# EAGLE schematic CT63_v1.0 (EAGLE 9.6.2)

## Sheet 1 of 3
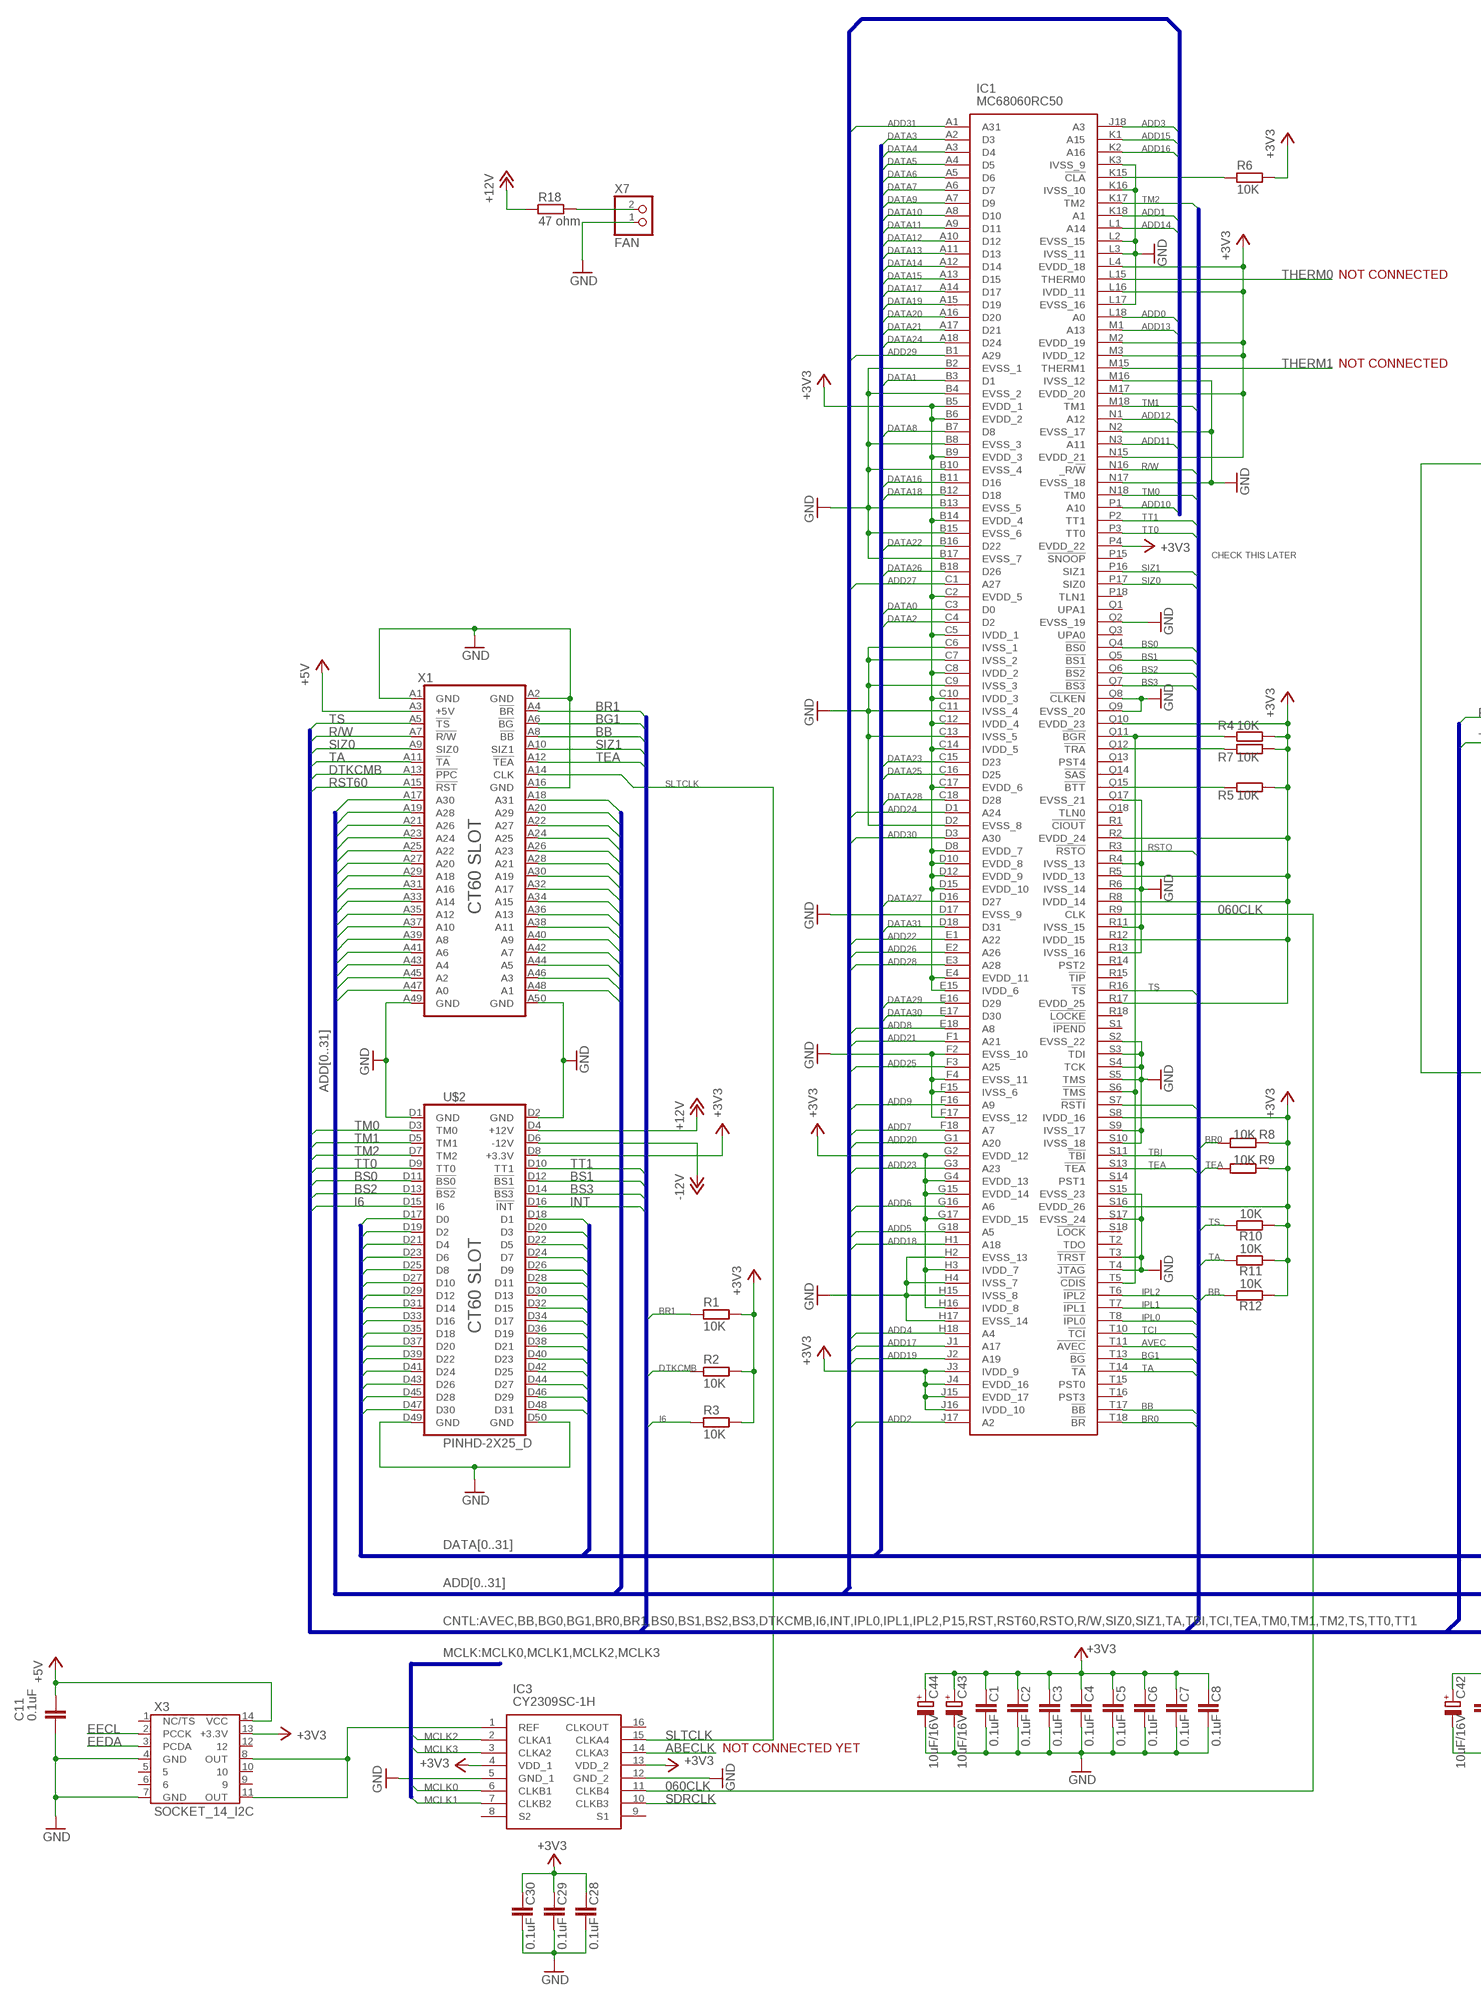
[diagram p0: schematic, sheet 1, part 1 of 2]
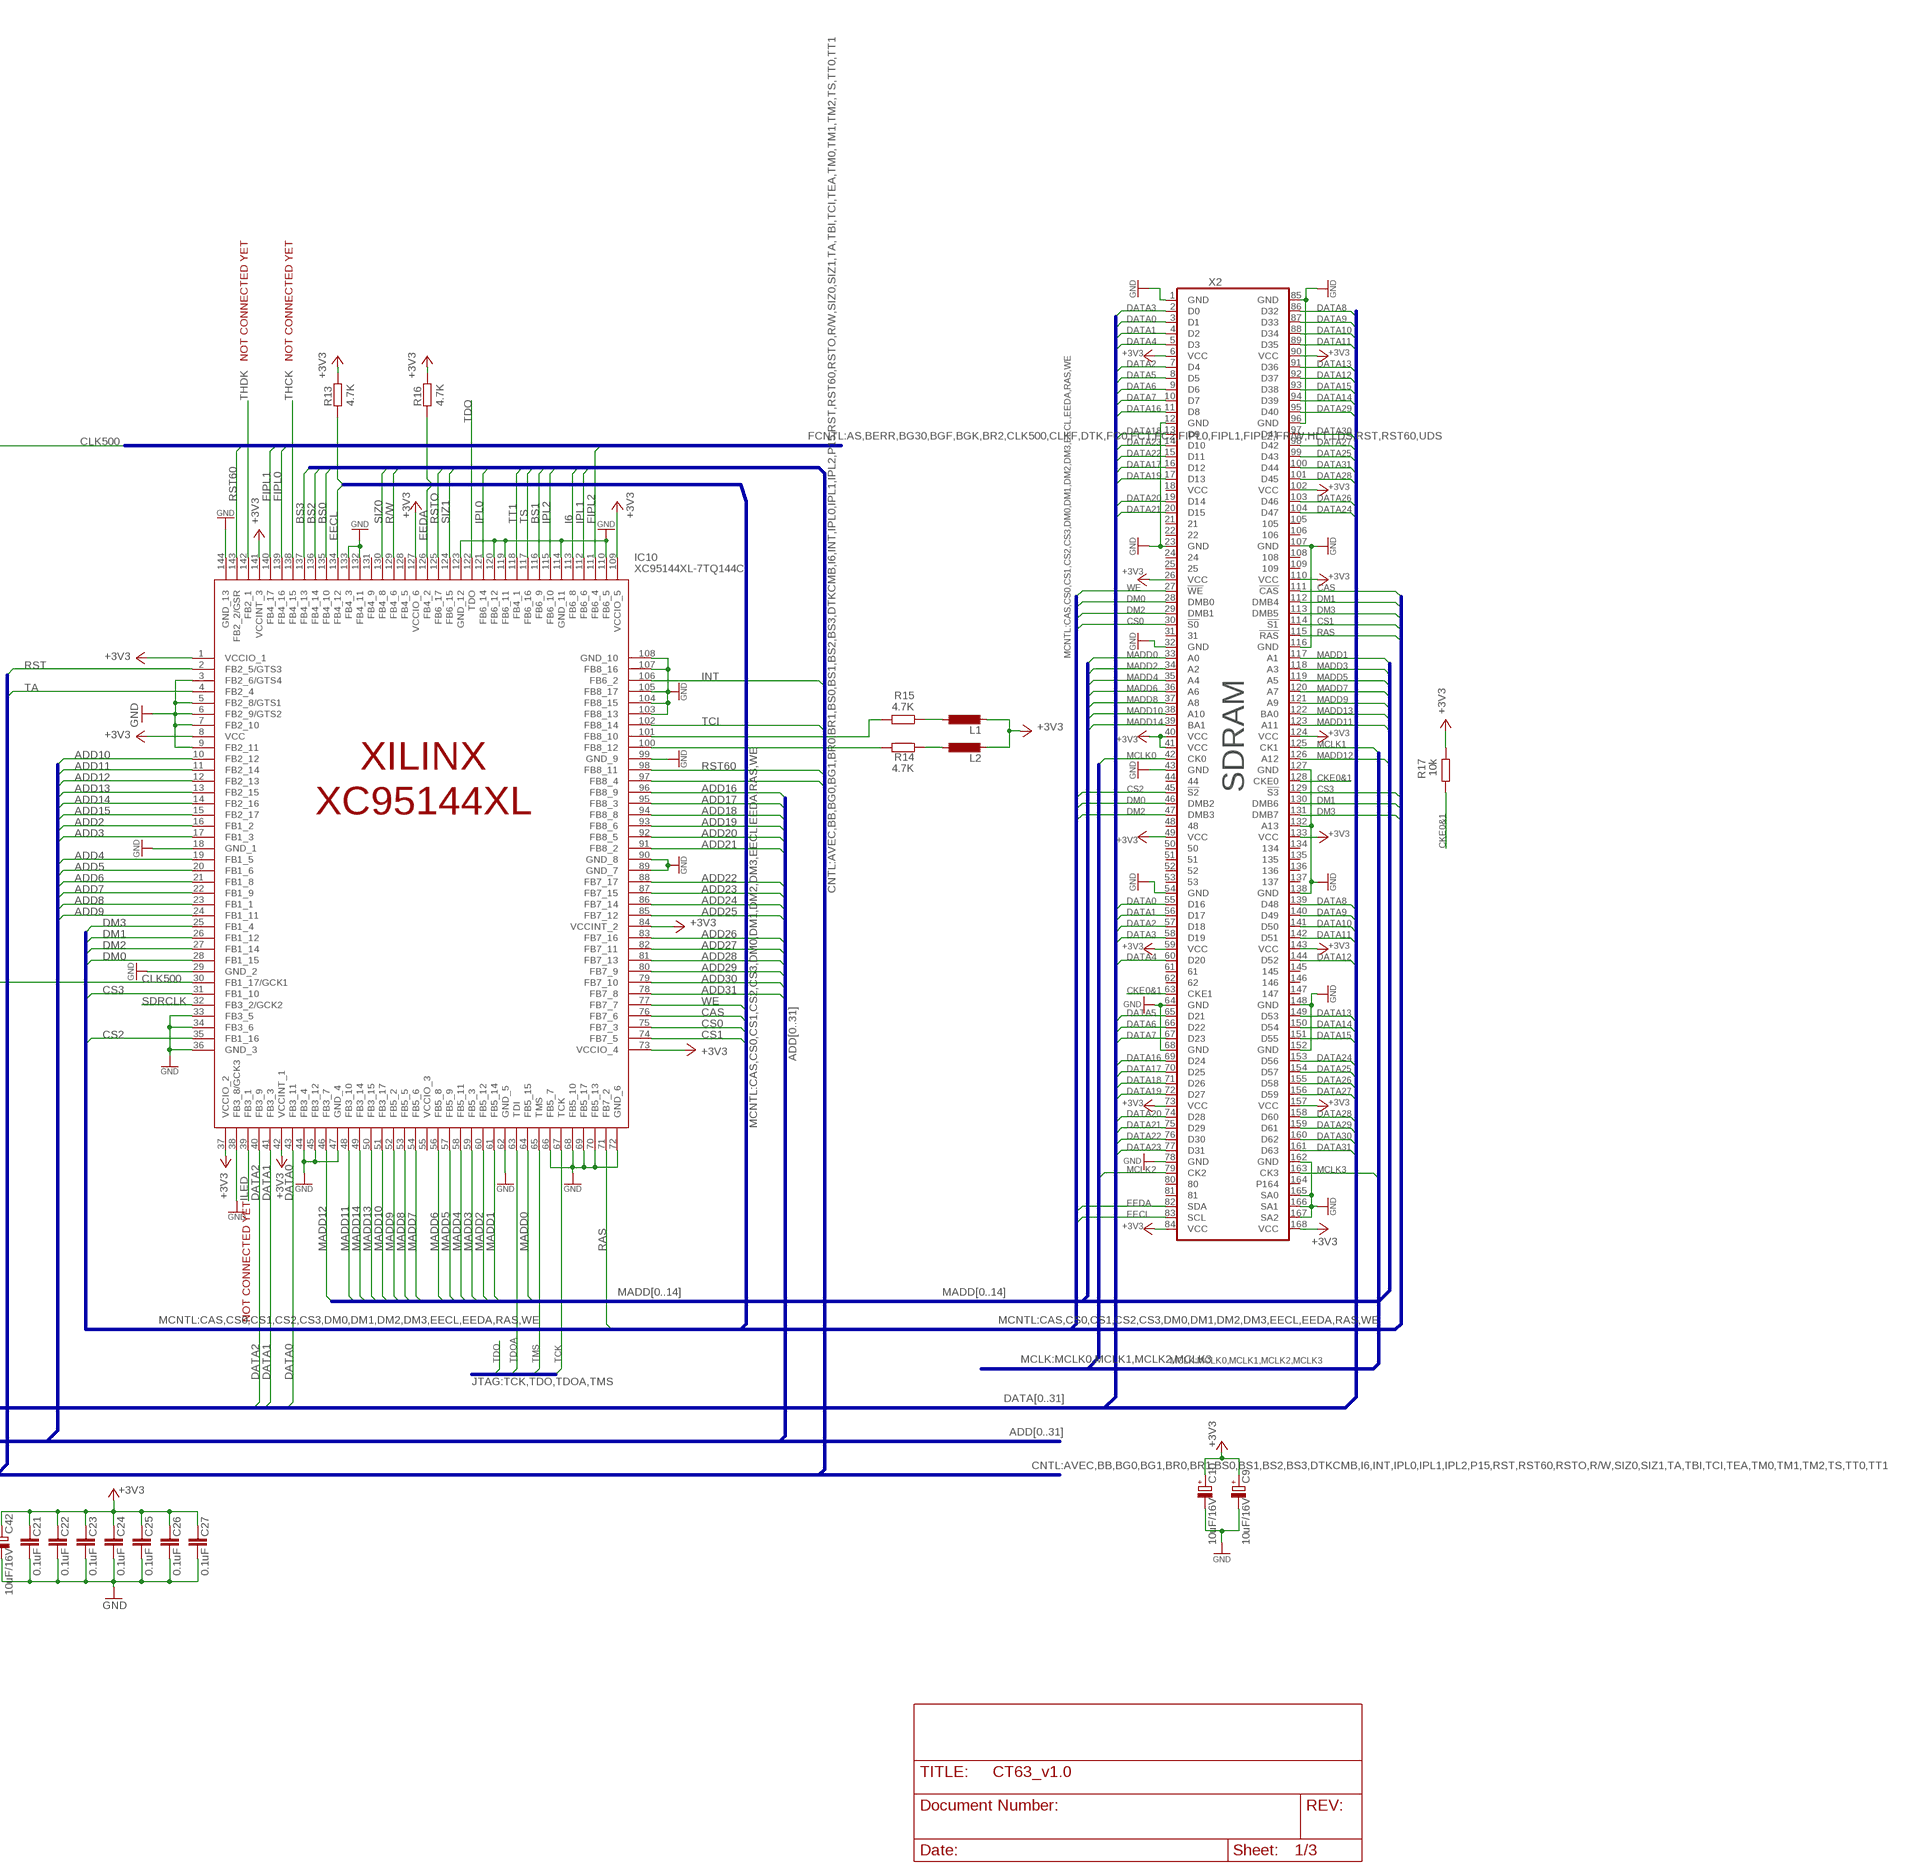
[diagram p1: schematic, sheet 1, part 2 of 2]

### Parts
C1  0.1uF  C-EUC0805  [C0805]
C2  0.1uF  C-EUC0805  [C0805]
C3  0.1uF  C-EUC0805  [C0805]
C4  0.1uF  C-EUC0805  [C0805]
C5  0.1uF  C-EUC0805  [C0805]
C6  0.1uF  C-EUC0805  [C0805]
C7  0.1uF  C-EUC0805  [C0805]
C8  0.1uF  C-EUC0805  [C0805]
C9  10uF/16V  CPOL-EUE2,5-6E  [E2,5-6E]
C10  10uF/16V  CPOL-EUE2,5-6E  [E2,5-6E]
C11  0.1uF  C-EUC0805  [C0805]
C21  0.1uF  C-EUC0805  [C0805]
C22  0.1uF  C-EUC0805  [C0805]
C23  0.1uF  C-EUC0805  [C0805]
C24  0.1uF  C-EUC0805  [C0805]
C25  0.1uF  C-EUC0805  [C0805]
C26  0.1uF  C-EUC0805  [C0805]
C27  0.1uF  C-EUC0805  [C0805]
C28  0.1uF  C-EUC0805  [C0805]
C29  0.1uF  C-EUC0805  [C0805]
C30  0.1uF  C-EUC0805  [C0805]
C42  10uF/16V  CPOL-EUE2,5-6E  [E2,5-6E]
C43  10uF/16V  CPOL-EUE2,5-6E  [E2,5-6E]
C44  10uF/16V  CPOL-EUE2,5-6E  [E2,5-6E]
IC1  MC68060RC50  [MC68060RC50]
IC3  CY2309SC-1H  [SOP65P638X110-16N]
IC10  XC95144XL-7TQ144C  [QFP50P2200X2200X160-144N]
L1  L-EUL3216C  [L3216C]
L2  L-EUL3216C  [L3216C]
R1  10K  R-EU_R0805  [R0805]
R2  10K  R-EU_R0805  [R0805]
R3  10K  R-EU_R0805  [R0805]
R4  10K  R-EU_R0805  [R0805]
R5  10K  R-EU_R0805  [R0805]
R6  10K  R-EU_R0805  [R0805]
R7  10K  R-EU_R0805  [R0805]
R8  10K  R-EU_R0805  [R0805]
R9  10K  R-EU_R0805  [R0805]
R10  10K  R-EU_R0805  [R0805]
R11  10K  R-EU_R0805  [R0805]
R12  10K  R-EU_R0805  [R0805]
R13  4.7K  R-EU_R0805  [R0805]
R14  4.7K  R-EU_R0805  [R0805]
R15  4.7K  R-EU_R0805  [R0805]
R16  4.7K  R-EU_R0805  [R0805]
R17  10k  R-EU_R0805  [R0805]
R18  47 ohm  R-EU_R0805  [R0805]
U$2  PINHD-2X25_D  [2X25_D]
X1  PINHD-2X25_A_2.54  [2X25_A]
X2  DIMM168  [390052-4]
X3  SOCKET_14_I2C  SOCKET14_I2C  [DIL14]
X7  FAN  JST_2PIN-THM  [JST-PH-2-THM]

### Nets
060CLK: IC1.R9(CLK) IC3.11(CLKB4)
+3V3: C1.1 C2.1 C3.1 C4.1 C5.1 C6.1 C7.1 C8.1 C9.+ C10.+ C21.1 C22.1 C23.1 C24.1 C25.1 C26.1 C27.1 C28.1 C29.1 C30.1 C42.+ C43.+ C44.+ IC1.B5(EVDD_1) IC1.B6(EVDD_2) IC1.B9(EVDD_3) IC1.B14(EVDD_4) IC1.C2(EVDD_5) IC1.C5(IVDD_1) IC1.C8(IVDD_2) IC1.C10(IVDD_3) IC1.C12(IVDD_4) IC1.C14(IVDD_5) IC1.C17(EVDD_6) IC1.D8(EVDD_7) IC1.D10(EVDD_8) IC1.D12(EVDD_9) IC1.D15(EVDD_10) IC1.E4(EVDD_11) IC1.E15(IVDD_6) IC1.G2(EVDD_12) IC1.G4(EVDD_13) IC1.G15(EVDD_14) IC1.G17(EVDD_15) IC1.H3(IVDD_7) IC1.H16(IVDD_8) IC1.J3(IVDD_9) IC1.J4(EVDD_16) IC1.J15(EVDD_17) IC1.J16(IVDD_10) IC1.L4(EVDD_18) IC1.L16(IVDD_11) IC1.M2(EVDD_19) IC1.M3(IVDD_12) IC1.M17(EVDD_20) IC1.N15(EVDD_21) IC1.P4(EVDD_22) IC1.Q10(EVDD_23) IC1.R2(EVDD_24) IC1.R5(IVDD_13) IC1.R8(IVDD_14) IC1.R12(IVDD_15) IC1.R17(EVDD_25) IC1.S8(IVDD_16) IC1.S16(EVDD_26) IC3.4(VDD_1) IC3.13(VDD_2) IC10.1(VCCIO_1) IC10.8(VCC) IC10.37(VCCIO_2) IC10.42(VCCINT_1) IC10.73(VCCIO_4) IC10.84(VCCINT_2) IC10.109(VCCIO_5) IC10.127(VCCIO_6) IC10.141(VCCINT_3) L1.2 L2.2 R1.2 R2.2 R3.2 R4.2 R5.2 R6.2 R7.2 R8.1 R9.1 R10.1 R11.1 R12.1 R13.2 R16.2 R17.1 U$2.D8(+3.3V) X2.6(VCC) X2.26(VCC) X2.40(VCC) X2.41(VCC) X2.49(VCC) X2.59(VCC) X2.73(VCC) X2.84(VCC) X2.90(VCC) X2.102(VCC) X2.110(VCC) X2.124(VCC) X2.133(VCC) X2.143(VCC) X2.157(VCC) X2.168(VCC) X3.13(+3.3V) ; also sheet 2
+5V: C11.1 X1.A3(+5V) X3.14(VCC) ; also sheet 2,3
+12V: R18.1 U$2.D4(+12V) ; also sheet 2
-12V: U$2.D6(-12V) ; also sheet 2
ABECLK: IC3.14(CLKA3) ; also sheet 2
ADD0: IC1.L18(A0) X1.A47(A0)
ADD1: IC1.K18(A1) X1.A48(A1)
ADD2: IC1.J17(A2) IC10.16(FB1_2) X1.A45(A2) ; also sheet 2
ADD3: IC1.J18(A3) IC10.17(FB1_3) X1.A46(A3) ; also sheet 2
ADD4: IC1.H18(A4) IC10.19(FB1_5) X1.A43(A4) ; also sheet 2
ADD5: IC1.G18(A5) IC10.20(FB1_6) X1.A44(A5) ; also sheet 2
ADD6: IC1.G16(A6) IC10.21(FB1_8) X1.A41(A6) ; also sheet 2
ADD7: IC1.F18(A7) IC10.22(FB1_9) X1.A42(A7) ; also sheet 2
ADD8: IC1.E18(A8) IC10.23(FB1_1) X1.A39(A8) ; also sheet 2
ADD9: IC1.F16(A9) IC10.24(FB1_11) X1.A40(A9) ; also sheet 2
ADD10: IC1.P1(A10) IC10.10(FB2_12) X1.A37(A10) ; also sheet 2
ADD11: IC1.N3(A11) IC10.11(FB2_14) X1.A38(A11) ; also sheet 2
ADD12: IC1.N1(A12) IC10.12(FB2_13) X1.A35(A12) ; also sheet 2
ADD13: IC1.M1(A13) IC10.13(FB2_15) X1.A36(A13) ; also sheet 2
ADD14: IC1.L1(A14) IC10.14(FB2_16) X1.A33(A14) ; also sheet 2
ADD15: IC1.K1(A15) IC10.15(FB2_17) X1.A34(A15) ; also sheet 2
ADD16: IC1.K2(A16) IC10.96(FB8_9) X1.A31(A16) ; also sheet 2
ADD17: IC1.J1(A17) IC10.95(FB8_3) X1.A32(A17) ; also sheet 2
ADD18: IC1.H1(A18) IC10.94(FB8_8) X1.A29(A18) ; also sheet 2
ADD19: IC1.J2(A19) IC10.93(FB8_6) X1.A30(A19) ; also sheet 2
ADD20: IC1.G1(A20) IC10.92(FB8_5) X1.A27(A20) ; also sheet 2
ADD21: IC1.F1(A21) IC10.91(FB8_2) X1.A28(A21) ; also sheet 2
ADD22: IC1.E1(A22) IC10.88(FB7_17) X1.A25(A22) ; also sheet 2
ADD23: IC1.G3(A23) IC10.87(FB7_15) X1.A26(A23) ; also sheet 2
ADD24: IC1.D1(A24) IC10.86(FB7_14) X1.A23(A24) ; also sheet 2
ADD25: IC1.F3(A25) IC10.85(FB7_12) X1.A24(A25) ; also sheet 2
ADD26: IC1.E2(A26) IC10.83(FB7_16) X1.A21(A26) ; also sheet 2
ADD27: IC1.C1(A27) IC10.82(FB7_11) X1.A22(A27) ; also sheet 2
ADD28: IC1.E3(A28) IC10.81(FB7_13) X1.A19(A28) ; also sheet 2
ADD29: IC1.B1(A29) IC10.80(FB7_9) X1.A20(A29) ; also sheet 2
ADD30: IC1.D3(A30) IC10.79(FB7_10) X1.A17(A30) ; also sheet 2
ADD31: IC1.A1(A31) IC10.78(FB7_8) X1.A18(A31) ; also sheet 2
AVEC: IC1.T11(!AVEC) ; also sheet 2
BB: IC1.T17(!BB) R12.2 X1.A8(!BB) ; also sheet 2
BG1: IC1.T13(!BG) X1.A6(!BG) ; also sheet 2
BR0: IC1.T18(!BR) R8.2 ; also sheet 2
BR1: R1.1 X1.A4(!BR) ; also sheet 2
BR2: IC1.Q11(!BGR) IC1.S6(!TMS) IC1.T5(!CDIS) R4.1 ; also sheet 2
BR3: IC1.K15(!CLA) R6.1
BS0: IC1.Q4(!BS0) IC10.135(FB4_10) U$2.D11(!BS0) ; also sheet 2
BS1: IC1.Q5(!BS1) IC10.116(FB6_9) U$2.D12(!BS1) ; also sheet 2
BS2: IC1.Q6(!BS2) IC10.136(FB4_14) U$2.D13(!BS2) ; also sheet 2
BS3: IC1.Q7(!BS3) IC10.137(FB4_13) U$2.D14(!BS3) ; also sheet 2
CAS: IC10.76(FB7_6) X2.111(!CAS)
CKE0&1: R17.2 X2.63(CKE1) X2.128(CKE0)
CLK500: IC10.30(FB1_17/GCK1) ; also sheet 2
CS0: IC10.75(FB7_3) X2.30(!S0)
CS1: IC10.74(FB7_5) X2.114(!S1)
CS2: IC10.35(FB1_16) X2.45(!S2)
CS3: IC10.31(FB1_10) X2.129(!S3)
DATA0: IC1.C3(D0) IC10.43(FB3_11) U$2.D17(D0) X2.3(D1) X2.55(D16) ; also sheet 2
DATA1: IC1.B3(D1) IC10.41(FB3_3) U$2.D18(D1) X2.4(D2) X2.56(D17) ; also sheet 2
DATA2: IC1.C4(D2) IC10.40(FB3_9) U$2.D19(D2) X2.7(D4) X2.57(D18) ; also sheet 2
DATA3: IC1.A2(D3) U$2.D20(D3) X2.2(D0) X2.58(D19) ; also sheet 2
DATA4: IC1.A3(D4) U$2.D21(D4) X2.5(D3) X2.60(D20) ; also sheet 2
DATA5: IC1.A4(D5) U$2.D22(D5) X2.8(D5) X2.65(D21) ; also sheet 2
DATA6: IC1.A5(D6) U$2.D23(D6) X2.9(D6) X2.66(D22) ; also sheet 2
DATA7: IC1.A6(D7) U$2.D24(D7) X2.10(D7) X2.67(D23) ; also sheet 2
DATA8: IC1.B7(D8) U$2.D25(D8) X2.86(D32) X2.139(D48) ; also sheet 2
DATA9: IC1.A7(D9) U$2.D26(D9) X2.87(D33) X2.140(D49) ; also sheet 2
DATA10: IC1.A8(D10) U$2.D27(D10) X2.88(D34) X2.141(D50) ; also sheet 2
DATA11: IC1.A9(D11) U$2.D28(D11) X2.89(D35) X2.142(D51) ; also sheet 2
DATA12: IC1.A10(D12) U$2.D29(D12) X2.92(D37) X2.144(D52) ; also sheet 2
DATA13: IC1.A11(D13) U$2.D30(D13) X2.91(D36) X2.149(D53) ; also sheet 2
DATA14: IC1.A12(D14) U$2.D31(D14) X2.94(D39) X2.150(D54) ; also sheet 2
DATA15: IC1.A13(D15) U$2.D32(D15) X2.93(D38) X2.151(D55) ; also sheet 2
DATA16: IC1.B11(D16) U$2.D33(D16) X2.11(D8) X2.69(D24) ; also sheet 2
DATA17: IC1.A14(D17) U$2.D34(D17) X2.16(D12) X2.70(D25) ; also sheet 2
DATA18: IC1.B12(D18) U$2.D35(D18) X2.13(D9) X2.71(D26) ; also sheet 2
DATA19: IC1.A15(D19) U$2.D36(D19) X2.17(D13) X2.72(D27) ; also sheet 2
DATA20: IC1.A16(D20) U$2.D37(D20) X2.19(D14) X2.74(D28) ; also sheet 2
DATA21: IC1.A17(D21) U$2.D38(D21) X2.20(D15) X2.75(D29) ; also sheet 2
DATA22: IC1.B16(D22) U$2.D39(D22) X2.15(D11) X2.76(D30) ; also sheet 2
DATA23: IC1.C15(D23) U$2.D40(D23) X2.14(D10) X2.77(D31) ; also sheet 2
DATA24: IC1.A18(D24) U$2.D41(D24) X2.104(D47) X2.153(D56) ; also sheet 2
DATA25: IC1.C16(D25) U$2.D42(D25) X2.99(D43) X2.154(D57) ; also sheet 2
DATA26: IC1.B18(D26) U$2.D43(D26) X2.103(D46) X2.155(D58) ; also sheet 2
DATA27: IC1.D16(D27) U$2.D44(D27) X2.98(D42) X2.156(D59) ; also sheet 2
DATA28: IC1.C18(D28) U$2.D45(D28) X2.101(D45) X2.158(D60) ; also sheet 2
DATA29: IC1.E16(D29) U$2.D46(D29) X2.95(D40) X2.159(D61) ; also sheet 2
DATA30: IC1.E17(D30) U$2.D47(D30) X2.97(D41) X2.160(D62) ; also sheet 2
DATA31: IC1.D18(D31) U$2.D48(D31) X2.100(D44) X2.161(D63) ; also sheet 2
DM0: IC10.28(FB1_15) X2.28(DMB0) X2.46(DMB2)
DM1: IC10.26(FB1_12) X2.112(DMB4) X2.130(DMB6)
DM2: IC10.27(FB1_14) X2.29(DMB1) X2.47(DMB3)
DM3: IC10.25(FB1_4) X2.113(DMB5) X2.131(DMB7)
DTKCMB: R2.1 X1.A13(!PPC) ; also sheet 2,3
DTKCMB1: IC1.Q15(!BTT) R5.1
EECL: IC10.134(FB4_12) R13.1 X2.83(SCL) X3.2(PCCK)
EEDA: IC10.126(FB4_2) R16.1 X2.82(SDA) X3.3(PCDA)
FIPL0: IC10.139(FB4_16) ; also sheet 2
FIPL1: IC10.140(FB4_17) ; also sheet 2
FIPL2: IC10.111(FB6_4) ; also sheet 2
GND: C1.2 C2.2 C3.2 C4.2 C5.2 C6.2 C7.2 C8.2 C9.- C10.- C11.2 C21.2 C22.2 C23.2 C24.2 C25.2 C26.2 C27.2 C28.2 C29.2 C30.2 C42.- C43.- C44.- IC1.B2(EVSS_1) IC1.B4(EVSS_2) IC1.B8(EVSS_3) IC1.B10(EVSS_4) IC1.B13(EVSS_5) IC1.B15(EVSS_6) IC1.B17(EVSS_7) IC1.C6(IVSS_1) IC1.C7(IVSS_2) IC1.C9(IVSS_3) IC1.C11(IVSS_4) IC1.C13(IVSS_5) IC1.D2(EVSS_8) IC1.D17(EVSS_9) IC1.F2(EVSS_10) IC1.F4(EVSS_11) IC1.F15(IVSS_6) IC1.F17(EVSS_12) IC1.H2(EVSS_13) IC1.H4(IVSS_7) IC1.H15(IVSS_8) IC1.H17(EVSS_14) IC1.K3(IVSS_9) IC1.K16(IVSS_10) IC1.L2(EVSS_15) IC1.L3(IVSS_11) IC1.L17(EVSS_16) IC1.M16(IVSS_12) IC1.N2(EVSS_17) IC1.N17(EVSS_18) IC1.Q2(EVSS_19) IC1.Q8(!CLKEN) IC1.Q9(EVSS_20) IC1.Q17(EVSS_21) IC1.R4(IVSS_13) IC1.R6(IVSS_14) IC1.R11(IVSS_15) IC1.R13(IVSS_16) IC1.S2(EVSS_22) IC1.S3(TDI) IC1.S4(TCK) IC1.S5(TMS) IC1.S9(IVSS_17) IC1.S10(IVSS_18) IC1.S15(EVSS_23) IC1.S17(EVSS_24) IC1.T3(!TRST) IC1.T4(!JTAG) IC3.5(GND_1) IC3.12(GND_2) IC10.3(FB2_6/GTS4) IC10.5(FB2_8/GTS1) IC10.6(FB2_9/GTS2) IC10.7(FB2_10) IC10.9(FB2_11) IC10.18(GND_1) IC10.29(GND_2) IC10.33(FB3_5) IC10.34(FB3_6) IC10.36(GND_3) IC10.38(FB3_8/GCK3) IC10.44(FB3_4) IC10.45(FB3_12) IC10.47(GND_4) IC10.62(GND_5) IC10.66(FB5_7) IC10.68(FB5_10) IC10.69(FB5_17) IC10.70(FB5_13) IC10.72(GND_6) IC10.89(GND_7) IC10.90(GND_8) IC10.99(GND_9) IC10.103(FB8_13) IC10.104(FB8_15) IC10.105(FB8_17) IC10.107(FB8_16) IC10.108(GND_10) IC10.110(FB6_5) IC10.114(GND_11) IC10.119(FB6_11) IC10.120(FB6_12) IC10.123(GND_12) IC10.132(FB4_11) IC10.133(FB4_3) IC10.144(GND_13) U$2.D1(GND) U$2.D2(GND) U$2.D49(GND) U$2.D50(GND) X1.A1(GND) X1.A2(GND) X1.A16(GND) X1.A49(GND) X1.A50(GND) X2.1(GND) X2.12(GND) X2.23(GND) X2.32(GND) X2.43(GND) X2.54(GND) X2.64(GND) X2.68(GND) X2.78(GND) X2.85(GND) X2.96(GND) X2.107(GND) X2.116(GND) X2.127(GND) X2.132(A13) X2.138(GND) X2.148(GND) X2.152(GND) X2.162(GND) X2.165(SA0) X2.166(SA1) X2.167(SA2) X3.4(GND) X3.7(GND) X7.1 ; also sheet 2,3
I6: IC10.113(FB6_8) R3.1 U$2.D15(I6) ; also sheet 2
ILED: IC10.39(FB3_1) ; also sheet 2
INT: IC10.106(FB6_2) U$2.D16(!INT)
IPL0: IC1.T8(!IPL0) IC10.121(FB6_14)
IPL1: IC1.T7(!IPL1) IC10.112(FB6_6)
IPL2: IC1.T6(!IPL2) IC10.115(FB6_10)
MADD0: IC10.64(FB5_15) X2.33(A0)
MADD1: IC10.61(FB5_14) X2.117(A1)
MADD2: IC10.60(FB5_12) X2.34(A2)
MADD3: IC10.59(FB5_3) X2.118(A3)
MADD4: IC10.58(FB5_11) X2.35(A4)
MADD5: IC10.57(FB5_9) X2.119(A5)
MADD6: IC10.56(FB5_8) X2.36(A6)
MADD7: IC10.54(FB5_6) X2.120(A7)
MADD8: IC10.53(FB5_5) X2.37(A8)
MADD9: IC10.52(FB5_2) X2.121(A9)
MADD10: IC10.51(FB3_17) X2.38(A10)
MADD11: IC10.48(FB3_10) X2.123(A11)
MADD12: IC10.46(FB3_7) X2.126(A12)
MADD13: IC10.50(FB3_15) X2.122(BA0)
MADD14: IC10.49(FB3_14) X2.39(BA1)
MCLK0: IC3.6(CLKB1) X2.42(CK0)
MCLK1: IC3.7(CLKB2) X2.125(CK1)
MCLK2: IC3.2(CLKA1) X2.79(CK2)
MCLK3: IC3.3(CLKA2) X2.163(CK3)
N$1: IC3.1(REF) X3.8(OUT) X3.11(OUT)
N$2: IC1.Q12(!TRA) R7.1
N$3: R18.2 X7.2
N$4: L1.1 R15.1
N$5: L2.1 R14.1
N$6: IC10.100(FB8_12) R14.2
N$7: IC10.101(FB8_10) R15.2
R/W: IC1.N16(_R/!W) IC10.129(FB4_6) X1.A7(!R/W) ; also sheet 2
RAS: IC10.71(FB7_2) X2.115(!RAS)
RST: IC10.2(FB2_5/GTS3) ; also sheet 2
RST60: IC1.S7(!RSTI) IC10.98(FB8_11) IC10.143(FB2_2/GSR) X1.A15(!RST) ; also sheet 2
RSTO: IC1.R3(!RSTO) IC10.125(FB6_17)
SDRCLK: IC3.10(CLKB3) IC10.32(FB3_2/GCK2)
SIZ0: IC1.P17(SIZ0) IC10.130(FB4_8) X1.A9(SIZ0)
SIZ1: IC1.P16(SIZ1) IC10.124(FB6_15) X1.A10(SIZ1)
SLTCLK: IC3.15(CLKA4) X1.A14(CLK)
TA: IC1.T14(!TA) IC10.4(FB2_4) R11.2 X1.A11(!TA) ; also sheet 2
TBI: IC1.S11(!TBI) IC10.97(FB8_4)
TCI: IC1.T10(!TCI) IC10.102(FB8_14)
TCK: IC10.67(TCK) ; also sheet 2
TDO: IC10.122(TDO) ; also sheet 2
TDOA: IC10.63(TDI) ; also sheet 2
TEA: IC1.S13(!TEA) R9.2 X1.A12(!TEA) ; also sheet 2
THCK: IC10.138(FB4_15)
THDK: IC10.142(FB2_1)
THERM0: IC1.L15(THERM0)
THERM1: IC1.M15(THERM1)
TM0: IC1.N18(TM0) U$2.D3(TM0) ; also sheet 2
TM1: IC1.M18(TM1) U$2.D5(TM1) ; also sheet 2
TM2: IC1.K17(TM2) U$2.D7(TM2) ; also sheet 2
TMS: IC10.65(TMS) ; also sheet 2
TS: IC1.R16(!TS) IC10.117(FB6_16) R10.2 X1.A5(!TS) ; also sheet 2
TT0: IC1.P3(TT0) U$2.D9(TT0) ; also sheet 2
TT1: IC1.P2(TT1) IC10.118(FB4_1) U$2.D10(TT1) ; also sheet 2
WE: IC10.77(FB7_7) X2.27(!WE)
Unconnected: IC1.P15(!SNOOP) IC1.P18(TLN1) IC1.Q1(UPA1) IC1.Q3(UPA0) IC1.Q13(PST4) IC1.Q14(!SAS) IC1.Q18(TLN0) IC1.R1(!CIOUT) IC1.R14(PST2) IC1.R15(!TIP) IC1.R18(!LOCKE) IC1.S1(!IPEND) IC1.S14(PST1) IC1.S18(!LOCK) IC1.T2(TDO) IC1.T15(PST0) IC1.T16(PST3) IC3.8(S2) IC3.9(S1) IC3.16(CLKOUT) IC10.128(FB4_5) IC10.131(FB4_9) X2.18(VCC) X2.21 X2.22 X2.24 X2.25 X2.31 X2.44 X2.48 X2.50 X2.51 X2.52 X2.53 X2.61 X2.62 X2.80 X2.81 X2.105 X2.106 X2.108 X2.109 X2.134 X2.135 X2.136 X2.137 X2.145 X2.146 X2.147 X2.164 X3.1(NC/TS) X3.5 X3.6 X3.9 X3.10 X3.12

### Buses
ADD[0..31]
DATA[0..31]
CNTL:AVEC,BB,BG0,BG1,BR0,BR1,BS0,BS1,BS2,BS3,DTKCMB,I6,INT,IPL0,IPL1,IPL2,P15,RST,RST60,RSTO,R/W,SIZ0,SIZ1,TA,TBI,TCI,TEA,TM0,TM1,TM2,TS,TT0,TT1
MCLK:MCLK0,MCLK1,MCLK2,MCLK3
MCNTL:CAS,CS0,CS1,CS2,CS3,DM0,DM1,DM2,DM3,EECL,EEDA,RAS,WE
MADD[0..14]
FCNTL:AS,BERR,BG30,BGF,BGK,BR2,CLK500,CLKF,DTK,FC0,FC1,FC2,FIPL0,FIPL1,FIPL2,FR/W,HLT,LDS,RST,RST60,UDS
JTAG:TCK,TDO,TDOA,TMS

### Notes on the sheet
- NOT CONNECTED
- NOT CONNECTED | NOT CONNECTED YET | NOT CONNECTED YET
- CHECK THIS LATER
- NOT CONNECTED YET
- NOT CONNECTED YET

## Sheet 2 of 3
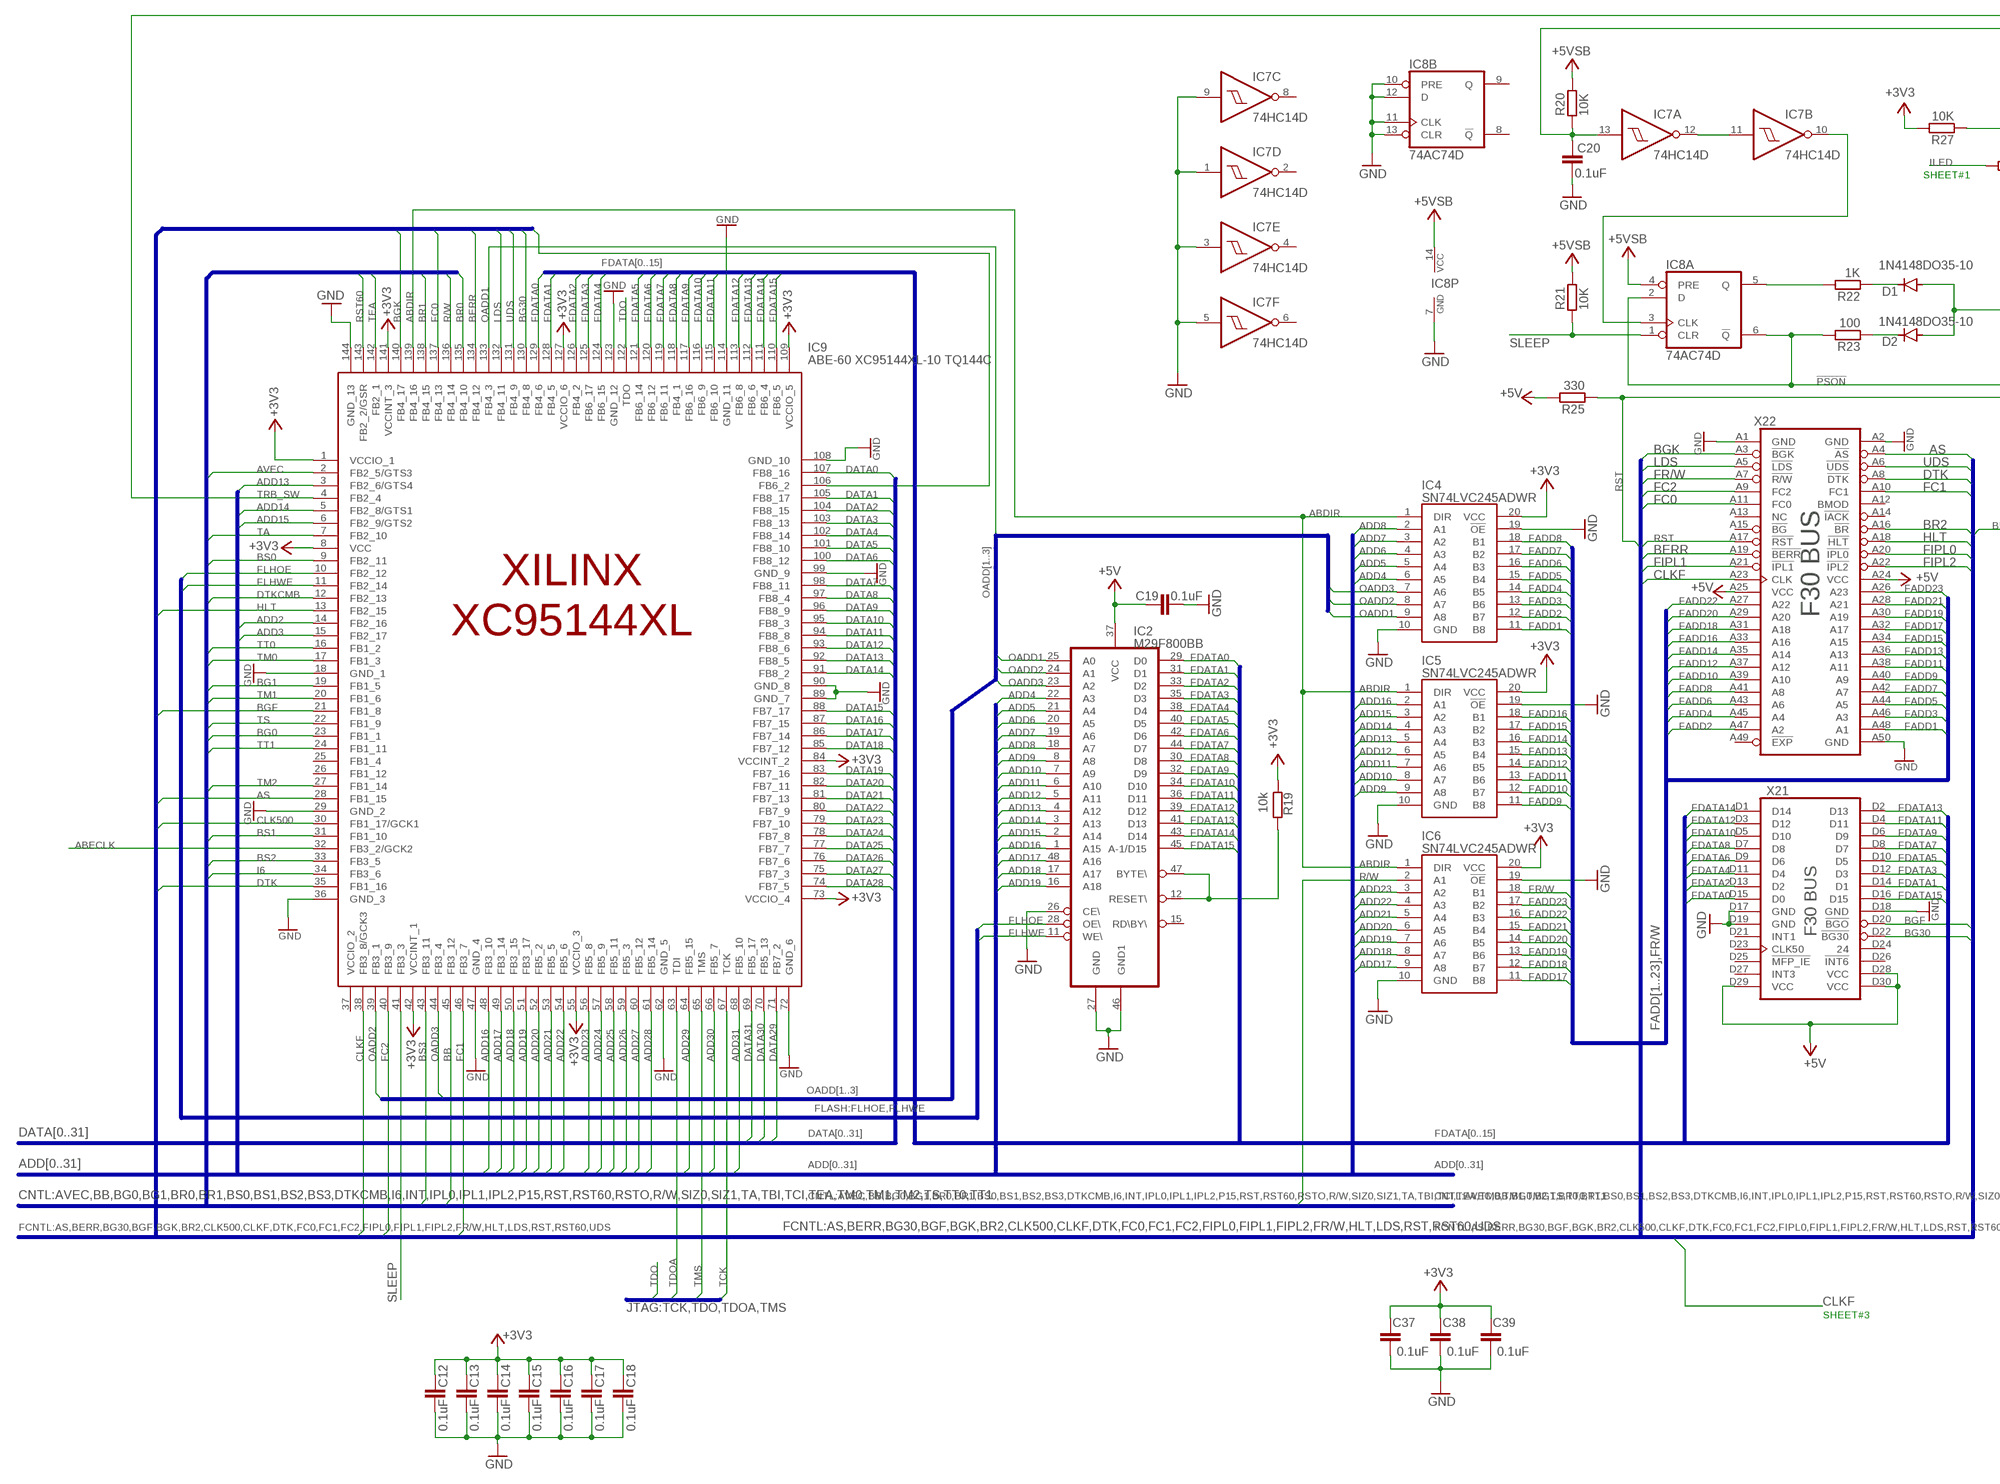
[diagram p2: schematic, sheet 2, part 1 of 2]
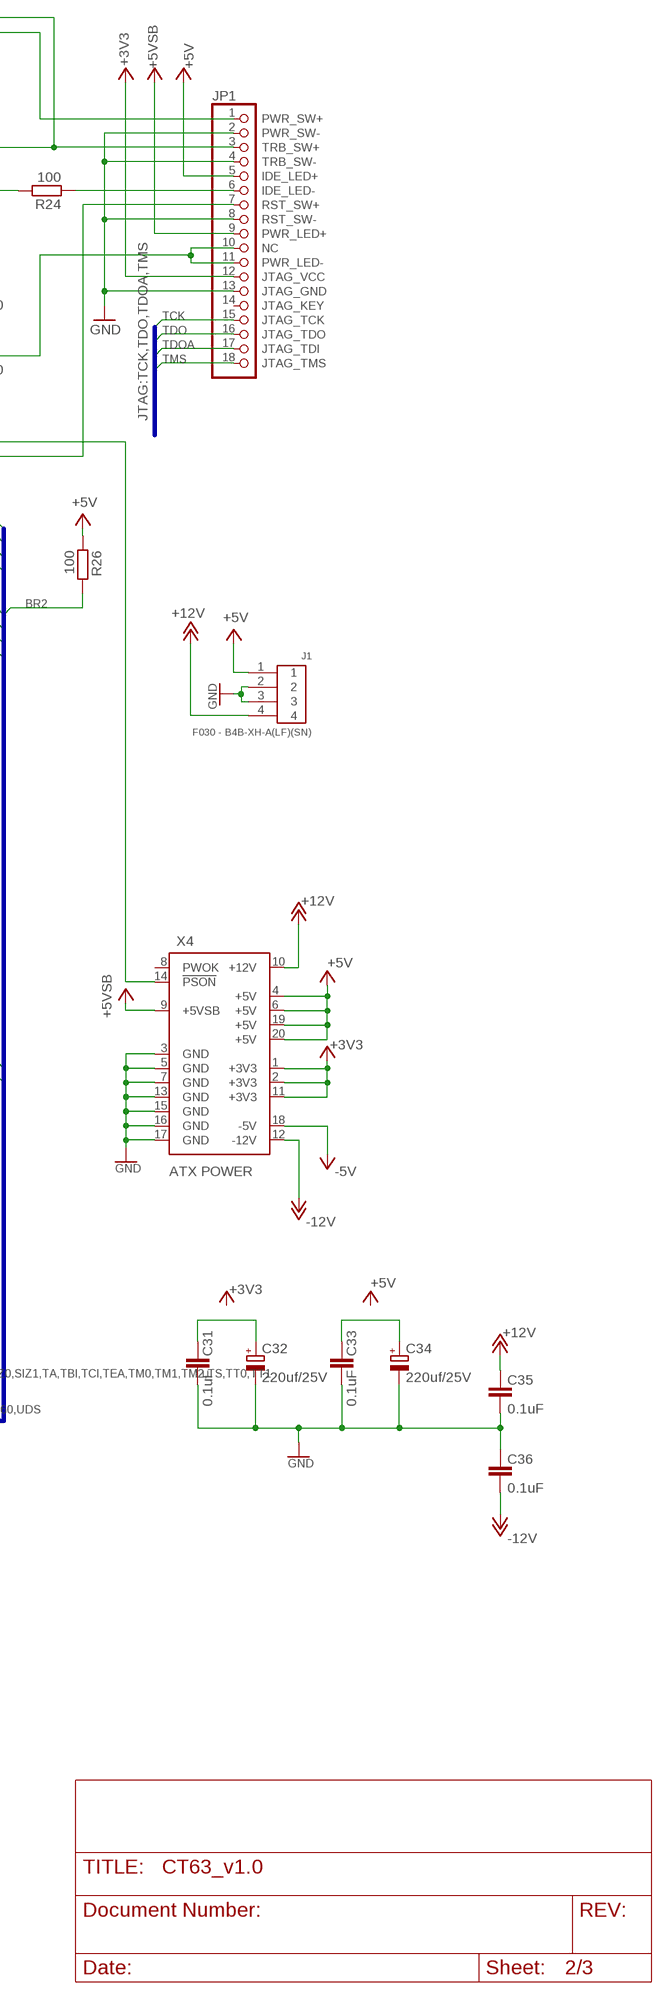
[diagram p3: schematic, sheet 2, part 2 of 2]

### Parts
C12  0.1uF  C-EUC0805  [C0805]
C13  0.1uF  C-EUC0805  [C0805]
C14  0.1uF  C-EUC0805  [C0805]
C15  0.1uF  C-EUC0805  [C0805]
C16  0.1uF  C-EUC0805  [C0805]
C17  0.1uF  C-EUC0805  [C0805]
C18  0.1uF  C-EUC0805  [C0805]
C19  0.1uF  C-EUC0805  [C0805]
C20  0.1uF  C-EUC0805  [C0805]
C31  0.1uF  C-EUC0805  [C0805]
C32  220uf/25V  CPOL-EUCT3216  [CT3216]
C33  0.1uF  C-EUC0805  [C0805]
C34  220uf/25V  CPOL-EUCT3216  [CT3216]
C35  0.1uF  C-EUC0805  [C0805]
C36  0.1uF  C-EUC0805  [C0805]
C37  0.1uF  C-EUC0805  [C0805]
C38  0.1uF  C-EUC0805  [C0805]
C39  0.1uF  C-EUC0805  [C0805]
D1  1N4148DO35-10  [DO35-10]
D2  1N4148DO35-10  [DO35-10]
IC2  M29F800BB  [M29F800BB]
IC4  SN74LVC245ADWR  [SOIC127P1030X265-20N]
IC5  SN74LVC245ADWR  [SOIC127P1030X265-20N]
IC6  SN74LVC245ADWR  [SOIC127P1030X265-20N]
IC7  74HC14D  [SO14]
IC8  74AC74D  [SO14]
IC9  ABE-60 XC95144XL-10 TQ144C  XC95144XL-7TQ144C  [QFP50P2200X2200X160-144N]
J1  F030 - B4B-XH-A(LF)(SN)  B4B-XH-A(LF)(SN)  [B4B-XH-A(LF)(SN)]
JP1  PINHD-1X18_2.54-S  [1X18-S]
R19  10k  R-EU_R0805  [R0805]
R20  10K  R-EU_R0805  [R0805]
R21  10K  R-EU_R0805  [R0805]
R22  1K  R-EU_R0805  [R0805]
R23  100  R-EU_R0805  [R0805]
R24  100  R-EU_R0805  [R0805]
R25  330  R-EU_R0805  [R0805]
R26  100  R-EU_R0805  [R0805]
R27  10K  R-EU_R0805  [R0805]
X4  ATX POWER  ATX-POWER_CON_5566-20  [5566-20]
X21  F30BUS-2X15_D_2.54  [F30BUS-2X15_D]
X22  F30BUS_A  [F30BUS_2X25_A]

### Nets
!PSON: IC8.2(A:D) IC8.6(A:!Q) R23.2 X4.14(!PSON)
+3V3: C12.1 C13.1 C14.1 C15.1 C16.1 C17.1 C18.1 C37.1 C38.1 C39.1 IC4.20(VCC) IC5.20(VCC) IC6.20(VCC) IC9.1(VCCIO_1) IC9.8(VCC) IC9.42(VCCINT_1) IC9.55(VCCIO_3) IC9.73(VCCIO_4) IC9.84(VCCINT_2) IC9.109(VCCIO_5) IC9.127(VCCIO_6) IC9.141(VCCINT_3) JP1.12(JTAG_VCC) R19.1 R27.2 X4.1(+3V3) X4.2(+3V3) X4.11(+3V3) ; also sheet 1
+5V: C19.1 IC2.37(VCC) IC8.4(A:PRE) IC8.14(P:VCC) J1.1 JP1.5(IDE_LED+) JP1.9(PWR_LED+) R20.2 R21.2 R25.2 R26.1 X4.4(+5V) X4.6(+5V) X4.9(+5VSB) X4.19(+5V) X4.20(+5V) X21.D28(VCC) X21.D29(VCC) X21.D30(VCC) X22.A24(VCC) X22.A25(VCC) ; supply symbol labelled +5VSB ; also sheet 1,3
+12V: C35.1 J1.4 X4.10(+12V) ; also sheet 1
-5V: X4.18(-5V)
-12V: C36.2 X4.12(-12V) ; also sheet 1
ABDIR: IC4.1(DIR) IC5.1(DIR) IC6.1(DIR) IC9.139(FB4_16)
ABECLK: IC9.32(FB3_2/GCK2) ; also sheet 1
ADD2: IC9.14(FB2_16) ; also sheet 1
ADD3: IC9.15(FB2_17) ; also sheet 1
ADD4: IC2.22(A3) IC4.6(A5) ; also sheet 1
ADD5: IC2.21(A4) IC4.5(A4) ; also sheet 1
ADD6: IC2.20(A5) IC4.4(A3) ; also sheet 1
ADD7: IC2.19(A6) IC4.3(A2) ; also sheet 1
ADD8: IC2.18(A7) IC4.2(A1) ; also sheet 1
ADD9: IC2.8(A8) IC5.9(A8) ; also sheet 1
ADD10: IC2.7(A9) IC5.8(A7) ; also sheet 1
ADD11: IC2.6(A10) IC5.7(A6) ; also sheet 1
ADD12: IC2.5(A11) IC5.6(A5) ; also sheet 1
ADD13: IC2.4(A12) IC5.5(A4) IC9.3(FB2_6/GTS4) ; also sheet 1
ADD14: IC2.3(A13) IC5.4(A3) IC9.5(FB2_8/GTS1) ; also sheet 1
ADD15: IC2.2(A14) IC5.3(A2) IC9.6(FB2_9/GTS2) ; also sheet 1
ADD16: IC2.1(A15) IC5.2(A1) IC9.48(FB3_10) ; also sheet 1
ADD17: IC2.48(A16) IC6.9(A8) IC9.49(FB3_14) ; also sheet 1
ADD18: IC2.17(A17) IC6.8(A7) IC9.50(FB3_15) ; also sheet 1
ADD19: IC2.16(A18) IC6.7(A6) IC9.51(FB3_17) ; also sheet 1
ADD20: IC6.6(A5) IC9.52(FB5_2) ; also sheet 1
ADD21: IC6.5(A4) IC9.53(FB5_5) ; also sheet 1
ADD22: IC6.4(A3) IC9.54(FB5_6) ; also sheet 1
ADD23: IC6.3(A2) IC9.56(FB5_8) ; also sheet 1
ADD24: IC9.57(FB5_9) ; also sheet 1
ADD25: IC9.58(FB5_11) ; also sheet 1
ADD26: IC9.59(FB5_3) ; also sheet 1
ADD27: IC9.60(FB5_12) ; also sheet 1
ADD28: IC9.61(FB5_14) ; also sheet 1
ADD29: IC9.64(FB5_15) ; also sheet 1
ADD30: IC9.66(FB5_7) ; also sheet 1
ADD31: IC9.68(FB5_10) ; also sheet 1
AS: IC9.28(FB1_15) X22.A4(!AS)
AVEC: IC9.2(FB2_5/GTS3) ; also sheet 1
BB: IC9.45(FB3_12) ; also sheet 1
BERR: IC9.134(FB4_12) X22.A19(!BERR)
BG0: IC9.23(FB1_1)
BG1: IC9.19(FB1_5) ; also sheet 1
BG30: IC9.130(FB4_8) X21.D22(!BG30)
BGF: IC9.21(FB1_8) X21.D20(!BGO)
BGK: IC9.140(FB4_17) X22.A3(!BGK)
BR0: IC9.135(FB4_10) ; also sheet 1
BR1: IC9.138(FB4_15) ; also sheet 1
BR2: IC9.106(FB6_2) R26.2 X22.A16(!BR) ; also sheet 1
BS0: IC9.9(FB2_11) ; also sheet 1
BS1: IC9.31(FB1_10) ; also sheet 1
BS2: IC9.33(FB3_5) ; also sheet 1
BS3: IC9.43(FB3_11) ; also sheet 1
CKE0&2: IC2.12(RESET\\) IC2.47(BYTE\\) R19.2
CLK500: IC9.30(FB1_17/GCK1) ; also sheet 1
CLKF: IC9.38(FB3_8/GCK3) X22.A23(CLK)
DATA0: IC9.107(FB8_16) ; also sheet 1
DATA1: IC9.105(FB8_17) ; also sheet 1
DATA2: IC9.104(FB8_15) ; also sheet 1
DATA3: IC9.103(FB8_13) ; also sheet 1
DATA4: IC9.102(FB8_14) ; also sheet 1
DATA5: IC9.101(FB8_10) ; also sheet 1
DATA6: IC9.100(FB8_12) ; also sheet 1
DATA7: IC9.98(FB8_11) ; also sheet 1
DATA8: IC9.97(FB8_4) ; also sheet 1
DATA9: IC9.96(FB8_9) ; also sheet 1
DATA10: IC9.95(FB8_3) ; also sheet 1
DATA11: IC9.94(FB8_8) ; also sheet 1
DATA12: IC9.93(FB8_6) ; also sheet 1
DATA13: IC9.92(FB8_5) ; also sheet 1
DATA14: IC9.91(FB8_2) ; also sheet 1
DATA15: IC9.88(FB7_17) ; also sheet 1
DATA16: IC9.87(FB7_15) ; also sheet 1
DATA17: IC9.86(FB7_14) ; also sheet 1
DATA18: IC9.85(FB7_12) ; also sheet 1
DATA19: IC9.83(FB7_16) ; also sheet 1
DATA20: IC9.82(FB7_11) ; also sheet 1
DATA21: IC9.81(FB7_13) ; also sheet 1
DATA22: IC9.80(FB7_9) ; also sheet 1
DATA23: IC9.79(FB7_10) ; also sheet 1
DATA24: IC9.78(FB7_8) ; also sheet 1
DATA25: IC9.77(FB7_7) ; also sheet 1
DATA26: IC9.76(FB7_6) ; also sheet 1
DATA27: IC9.75(FB7_3) ; also sheet 1
DATA28: IC9.74(FB7_5) ; also sheet 1
DATA29: IC9.71(FB7_2) ; also sheet 1
DATA30: IC9.70(FB5_13) ; also sheet 1
DATA31: IC9.69(FB5_17) ; also sheet 1
DTK: IC9.35(FB1_16) X22.A8(!DTK)
DTKCMB: IC9.12(FB2_13) ; also sheet 1,3
FADD1: IC4.11(B8) X22.A48(A1)
FADD2: IC4.12(B7) X22.A47(A2)
FADD3: IC4.13(B6) X22.A46(A3)
FADD4: IC4.14(B5) X22.A45(A4)
FADD5: IC4.15(B4) X22.A44(A5)
FADD6: IC4.16(B3) X22.A43(A6)
FADD7: IC4.17(B2) X22.A42(A7)
FADD8: IC4.18(B1) X22.A41(A8)
FADD9: IC5.11(B8) X22.A40(A9)
FADD10: IC5.12(B7) X22.A39(A10)
FADD11: IC5.13(B6) X22.A38(A11)
FADD12: IC5.14(B5) X22.A37(A12)
FADD13: IC5.15(B4) X22.A36(A13)
FADD14: IC5.16(B3) X22.A35(A14)
FADD15: IC5.17(B2) X22.A34(A15)
FADD16: IC5.18(B1) X22.A33(A16)
FADD17: IC6.11(B8) X22.A32(A17)
FADD18: IC6.12(B7) X22.A31(A18)
FADD19: IC6.13(B6) X22.A30(A19)
FADD20: IC6.14(B5) X22.A29(A20)
FADD21: IC6.15(B4) X22.A28(A21)
FADD22: IC6.16(B3) X22.A27(A22)
FADD23: IC6.17(B2) X22.A26(A23)
FC0: IC9.137(FB4_13) X22.A11(FC0)
FC1: IC9.46(FB3_7) X22.A10(FC1)
FC2: IC9.40(FB3_9) X22.A9(FC2)
FDATA0: IC2.29(D0) IC9.129(FB4_6) X21.D15(D0)
FDATA1: IC2.31(D1) IC9.128(FB4_5) X21.D14(D1)
FDATA2: IC2.33(D2) IC9.126(FB4_2) X21.D13(D2)
FDATA3: IC2.35(D3) IC9.125(FB6_17) X21.D12(D3)
FDATA4: IC2.38(D4) IC9.124(FB6_15) X21.D11(D4)
FDATA5: IC2.40(D5) IC9.121(FB6_14) X21.D10(D5)
FDATA6: IC2.42(D6) IC9.120(FB6_12) X21.D9(D6)
FDATA7: IC2.44(D7) IC9.119(FB6_11) X21.D8(D7)
FDATA8: IC2.30(D8) IC9.118(FB4_1) X21.D7(D8)
FDATA9: IC2.32(D9) IC9.117(FB6_16) X21.D6(D9)
FDATA10: IC2.34(D10) IC9.116(FB6_9) X21.D5(D10)
FDATA11: IC2.36(D11) IC9.115(FB6_10) X21.D4(D11)
FDATA12: IC2.39(D12) IC9.113(FB6_8) X21.D3(D12)
FDATA13: IC2.41(D13) IC9.112(FB6_6) X21.D2(D13)
FDATA14: IC2.43(D14) IC9.111(FB6_4) X21.D1(D14)
FDATA15: IC2.45(A-1/D15) IC9.110(FB6_5) X21.D16(D15)
FIPL0: X22.A20(!IPL0) ; also sheet 1
FIPL1: X22.A21(!IPL1) ; also sheet 1
FIPL2: X22.A22(!IPL2) ; also sheet 1
FLHOE: IC2.28(OE\\) IC9.10(FB2_12)
FLHWE: IC2.11(WE\\) IC9.11(FB2_14)
FR/W: IC6.18(B1) X22.A7(!R/W)
GND: C12.2 C13.2 C14.2 C15.2 C16.2 C17.2 C18.2 C19.2 C20.2 C31.2 C32.- C33.2 C34.- C35.2 C36.1 C37.2 C38.2 C39.2 IC2.26(CE\\) IC2.27(GND) IC2.46(GND1) IC4.10(GND) IC4.19(!OE) IC5.10(GND) IC5.19(!OE) IC6.10(GND) IC6.19(!OE) IC7.1(D:I) IC7.3(E:I) IC7.5(F:I) IC7.9(C:I) IC8.7(P:GND) IC8.10(B:PRE) IC8.11(B:CLK) IC8.12(B:D) IC8.13(B:CLR) IC9.18(GND_1) IC9.29(GND_2) IC9.36(GND_3) IC9.47(GND_4) IC9.62(GND_5) IC9.72(GND_6) IC9.89(GND_7) IC9.90(GND_8) IC9.99(GND_9) IC9.108(GND_10) IC9.114(GND_11) IC9.123(GND_12) IC9.144(GND_13) J1.2 J1.3 JP1.2(PWR_SW-) JP1.4(TRB_SW-) JP1.8(RST_SW-) JP1.13(JTAG_GND) X4.3(GND) X4.5(GND) X4.7(GND) X4.13(GND) X4.15(GND) X4.16(GND) X4.17(GND) X21.D17(GND) X21.D18(GND) X21.D19(GND) X22.A1(GND) X22.A2(GND) X22.A50(GND) ; also sheet 1,3
HLT: IC9.13(FB2_15) X22.A18(!HLT)
I6: IC9.34(FB3_6) ; also sheet 1
ILED: R24.2 ; also sheet 1
LDS: IC9.132(FB4_11) X22.A5(!LDS)
N$8: IC8.5(A:Q) R22.2
N$10: IC7.11(B:I) IC7.12(A:O)
N$11: C20.1 IC7.13(A:I) JP1.1(PWR_SW+) R20.1
N$12: IC7.10(B:O) IC8.3(A:CLK)
N$13: D1.C R22.1
N$14: D2.C R23.1
N$15: C31.1 C32.+
N$16: D1.A D2.A JP1.10(NC) JP1.11(PWR_LED-)
N$17: JP1.6(IDE_LED-) R24.1
N$18: C33.1 C34.+
OADD1: IC2.25(A0) IC4.9(A8) IC9.133(FB4_3)
OADD2: IC2.24(A1) IC4.8(A7) IC9.39(FB3_1)
OADD3: IC2.23(A2) IC4.7(A6) IC9.44(FB3_4)
R/W: IC6.2(A1) IC9.136(FB4_14) ; also sheet 1
RST: JP1.7(RST_SW+) R25.1 X22.A17(!RST) ; also sheet 1
RST60: IC9.143(FB2_2/GSR) ; also sheet 1
SLEEP: IC8.1(A:CLR) IC9.41(FB3_3) R21.1
TA: IC9.7(FB2_10) ; also sheet 1
TCK: IC9.67(TCK) JP1.15(JTAG_TCK) ; also sheet 1
TDO: IC9.122(TDO) JP1.16(JTAG_TDO) ; also sheet 1
TDOA: IC9.63(TDI) JP1.17(JTAG_TDI) ; also sheet 1
TEA: IC9.142(FB2_1) ; also sheet 1
TM0: IC9.17(FB1_3) ; also sheet 1
TM1: IC9.20(FB1_6) ; also sheet 1
TM2: IC9.27(FB1_14) ; also sheet 1
TMS: IC9.65(TMS) JP1.18(JTAG_TMS) ; also sheet 1
TRB_SW: IC9.4(FB2_4) JP1.3(TRB_SW+) R27.1 ; also sheet 3
TS: IC9.22(FB1_9) ; also sheet 1
TT0: IC9.16(FB1_2) ; also sheet 1
TT1: IC9.24(FB1_11) ; also sheet 1
UDS: IC9.131(FB4_9) X22.A6(!UDS)
Unconnected: IC2.15(RD\\BY\\) IC7.2(D:O) IC7.4(E:O) IC7.6(F:O) IC7.8(C:O) IC8.8(B:!Q) IC8.9(B:Q) IC9.25(FB1_4) IC9.26(FB1_12) JP1.14(JTAG_KEY) X4.8(PWOK) X21.D21(INT1) X21.D23(CLK50) X21.D24 X21.D25(!MFP_IE) X21.D26(!INT6) X21.D27(INT3) X22.A12(BMOD) X22.A13(NC) X22.A14(!IACK) X22.A15(!BG) X22.A49(!EXP)

### Buses
ADD[0..31]
DATA[0..31]
CNTL:AVEC,BB,BG0,BG1,BR0,BR1,BS0,BS1,BS2,BS3,DTKCMB,I6,INT,IPL0,IPL1,IPL2,P15,RST,RST60,RSTO,R/W,SIZ0,SIZ1,TA,TBI,TCI,TEA,TM0,TM1,TM2,TS,TT0,TT1
FDATA[0..15]
FLASH:FLHOE,FLHWE
OADD[1..3]
FADD[1..23],FR/W
JTAG:TCK,TDO,TDOA,TMS
FCNTL:AS,BERR,BG30,BGF,BGK,BR2,CLK500,CLKF,DTK,FC0,FC1,FC2,FIPL0,FIPL1,FIPL2,FR/W,HLT,LDS,RST,RST60,UDS

### Notes on the sheet
- SHEET#1
- SHEET#3

## Sheet 3 of 3
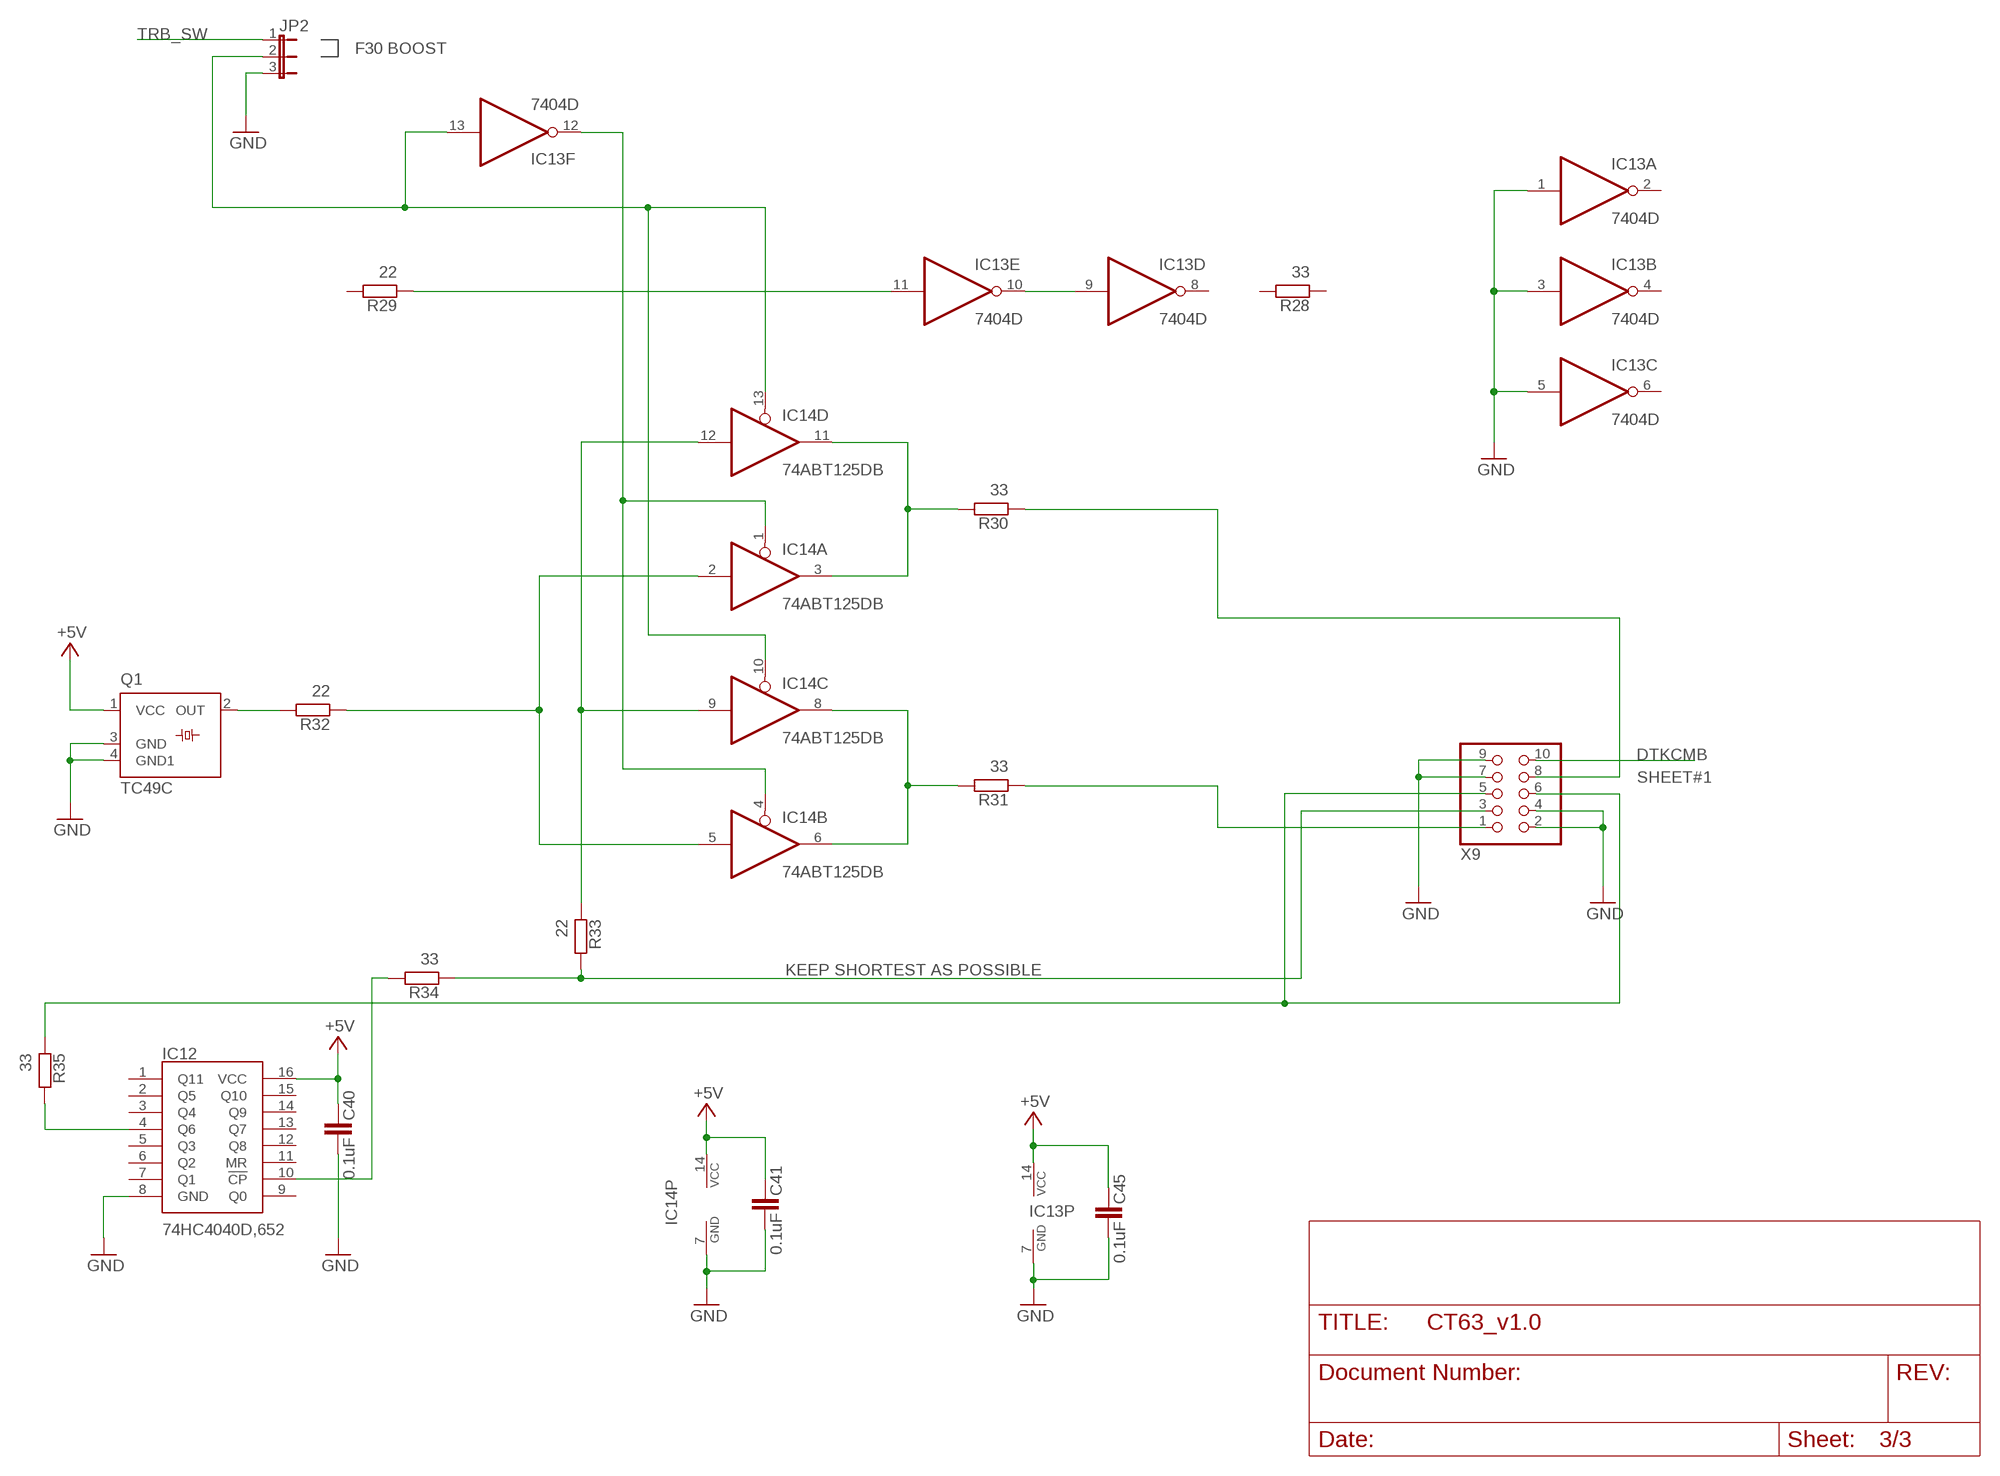
[diagram p4: schematic, sheet 3]

### Parts
C40  0.1uF  C-EUC0805  [C0805]
C41  0.1uF  C-EUC0805  [C0805]
C45  0.1uF  C-EUC0805  [C0805]
IC12  74HC4040D,652  [SOIC127P600X175-16N]
IC13  7404D  [SO14]
IC14  74ABT125DB  [SSOP14]
JP2  JP2E  [JP2]
Q1  TC49C  [TC49]
R28  33  R-EU_R0805  [R0805]
R29  22  R-EU_R0805  [R0805]
R30  33  R-EU_R0805  [R0805]
R31  33  R-EU_R0805  [R0805]
R32  22  R-EU_R0805  [R0805]
R33  22  R-EU_R0805  [R0805]
R34  33  R-EU_R0805  [R0805]
R35  33  R-EU_R0805  [R0805]
X9  PINHD-2X05_2.54  [2X05]

### Nets
+5V: C40.1 C41.1 C45.1 IC12.16(VCC) IC13.14(P:VCC) IC14.14(P:VCC) Q1.1(VCC) ; also sheet 1,2
DTKCMB: X9.10 ; also sheet 1,2
GND: C40.2 C41.2 C45.2 IC12.8(GND) IC13.1(A:I) IC13.3(B:I) IC13.5(C:I) IC13.7(P:GND) IC14.7(P:GND) JP2.3 Q1.3(GND) Q1.4(GND1) X9.2 X9.4 X9.7 X9.9 ; also sheet 1,2
N$9: IC13.9(D:I) IC13.10(E:O)
N$19: IC13.11(E:I) R29.1
N$20: IC13.13(F:I) IC14.10(C:OE) IC14.13(D:OE) JP2.2
N$21: IC13.12(F:O) IC14.1(A:OE) IC14.4(B:OE)
N$22: IC14.3(A:O) IC14.11(D:O) R30.2
N$23: IC14.6(B:O) IC14.8(C:O) R31.2
N$24: IC14.2(A:I) IC14.5(B:I) R32.1
N$25: IC14.9(C:I) IC14.12(D:I) R33.1
N$26: R33.2 R34.1 X9.3
N$27: IC12.10(!CP) R34.2
N$28: R31.1 X9.1
N$29: R30.1 X9.8
N$30: R35.1 X9.5 X9.6
N$31: IC12.4(Q6) R35.2
N$32: Q1.2(OUT) R32.2
TRB_SW: JP2.1 ; also sheet 2
Unconnected: IC12.1(Q11) IC12.2(Q5) IC12.3(Q4) IC12.5(Q3) IC12.6(Q2) IC12.7(Q1) IC12.9(Q0) IC12.11(MR) IC12.12(Q8) IC12.13(Q7) IC12.14(Q9) IC12.15(Q10) IC13.2(A:O) IC13.4(B:O) IC13.6(C:O) IC13.8(D:O) R28.1 R28.2 R29.2

### Notes on the sheet
- F30 BOOST
- SHEET#1
- KEEP SHORTEST AS POSSIBLE

## Power pins joined to a net without a drawn wire
GND: IC7.7(P:GND)
VCC: IC7.14(P:VCC)
VCCIO_2: IC9.37(VCCIO_2)
VCCIO_3: IC10.55(VCCIO_3)

## Library data of the parts
C1-C8 C11-C31 C33 C35-C41 C45 = rcl:C-EU: CAPACITOR, European symbol; SPICEPREFIX: C
C9 C10 C32 C34 C42-C44 = rcl:CPOL-EU: POLARIZED CAPACITOR, European symbol; SPICEPREFIX: C
D1 D2 = diode:1N4148: DIODE high speed (Philips)
IC1 = MC68060RC50:MC68060RC50: Microprocessors - MPU 32B W/ CACHE MMU FPU Source: Datasheet <https://componentsearchengine.com/Datasheets/1/MC68060RC50.pdf>; ARROW_PART_NUMBER: MC68060RC50; DESCRIPTION: Microprocessors - MPU 32B W/ CACHE MMU FPU; HEIGHT: 3.05mm; MANUFACTURER_NAME: Nexperia; MANUFACTURER_PART_NUMBER: MC68060RC50; MOUSER_PART_NUMBER: 841-MC68060RC50; MOUSER_PRICE-STOCK: https://www.mouser.com/Search/Refine.aspx?Keyword=841-MC68060RC50
IC2 = M29F800BB:M29F800BB: TSSOP-1-48; A1_MIN: 0.1; A_MAX: 1.2; A_MIN: 1.2; A_NOM: 1.2; B_MAX: 0.27; B_MIN: 0.17; B_NOM: 0.22; D2_MAX: 0.0; D_MAX: 12.2; D_MIN: 11.8; D_NOM: 12.0; E1_MAX: 18.6; E1_MIN: 18.2; E1_NOM: 18.4; E2_MAX: 0.0; ENOM: 0.5; E_MAX: 20.2; E_MIN: 19.8; E_NOM: 20.0; L_MAX: 0.7; L_MIN: 0.5; L_NOM: 0.6; MANUFACTURER: ISSI; PIN_COUNT: 48.0; SNAPEDA_PACKAGE_ID: 27909; STANDARD: IPC 7351B
IC3 = CY2309SC-1H:CY2309SC-1H: Zero delaybuffer,CY2309SC-1H 10-133.3MHz Source: Datasheet <https://eu.mouser.com/datasheet/2/100/38-07140_CY2305_CY2309_LOW_COST_3.3_V_ZERO_DELAY_B-1020720.pdf>; ARROW_PART_NUMBER: CY2309SC-1H; DESCRIPTION: Zero delaybuffer,CY2309SC-1H 10-133.3MHz; HEIGHT: 1.1mm; MANUFACTURER_NAME: Cypress Semiconductor; MANUFACTURER_PART_NUMBER: CY2309SC-1H
IC4-IC6 = SN74LVC245ADWR:SN74LVC245ADWR: TEXAS INSTRUMENTS - SN74LVC245ADWR - IC, 74LVC, SMD, 74LVC245, SOIC20 Source: Datasheet <http://www.farnell.com/datasheets/1830960.pdf>; ARROW_PART_NUMBER: SN74LVC245ADWR; ARROW_PRICE-STOCK: https://www.arrow.com/en/products/sn74lvc245adwr/texas-instruments; DESCRIPTION: TEXAS INSTRUMENTS - SN74LVC245ADWR - IC, 74LVC, SMD, 74LVC245, SOIC20; HEIGHT: 2.65mm; MANUFACTURER_NAME: Texas Instruments; MANUFACTURER_PART_NUMBER: SN74LVC245ADWR; MOUSER_PART_NUMBER: 595-SN74LVC245ADWR; MOUSER_PRICE-STOCK: https://www.mouser.co.uk/ProductDetail/Texas-Instruments/SN74LVC245ADWR?qs=WzgTT80quPGdOFCXqni3uA%3D%3D
IC7 = 74xx-eu:74*14: Hex schmitt trigger INVERTER
IC8 = 74xx-eu:74*74: Dual D type positive edge triggered FLIP FLOP, preset and clear
IC9 IC10 = XC95144XL-7TQ144C:XC95144XL-7TQ144C: CPLD - Complex Programmable Logic Devices 3.3V 144-mc CPLD Source: Datasheet <http://www.xilinx.com/support/documentation/data_sheets/ds056.pdf>; ARROW_PART_NUMBER: XC95144XL-7TQ144C; DESCRIPTION: CPLD - Complex Programmable Logic Devices 3.3V 144-mc CPLD; HEIGHT: 1.6mm; MANUFACTURER_NAME: XILINX; MANUFACTURER_PART_NUMBER: XC95144XL-7TQ144C
IC12 = 74HC4040D_652:74HC4040D,652: 74HC(T)4040 - 12-stage binary ripple counter@en-us Source: Datasheet <https://assets.nexperia.com/documents/data-sheet/74HC_HCT4040.pdf>; ARROW_PART_NUMBER: 74HC4040D,652; ARROW_PRICE-STOCK: https://www.arrow.com/en/products/74hc4040d652/nexperia; DESCRIPTION: 74HC(T)4040 - 12-stage binary ripple counter@en-us; HEIGHT: 1.75mm; MANUFACTURER_NAME: Nexperia; MANUFACTURER_PART_NUMBER: 74HC4040D,652; MOUSER_PART_NUMBER: 771-HC4040D652; MOUSER_PRICE-STOCK: https://www.mouser.co.uk/ProductDetail/Nexperia/74HC4040D652?qs=P62ublwmbi%252BprP5gU1ILjQ%3D%3D
IC13 = 74xx-eu:74*04: Hex INVERTER
IC14 = 74xx-eu:74*125: Quad bus BUFFER, 3-state
J1 = Headers:B4B-XH-A(LF)(SN): CONN HEADER VERT 4POS 2.5MM Manufacturer's datasheet <http://www.jst-mfg.com/product/pdf/eng/eXH.pdf>; CREATED_BY: PCBLayout.com; DIGIKEY_PARTNO: 455-2249-ND; MANUFACTURER: JST Sales America Inc.; MPN: B4B-XH-A(LF)(SN)
JP1 = PINHEADER:PINHD-1X18: PIN HEADER
JP2 = jumper:JP2E: JUMPER
L1 L2 = rcl:L-EU: INDUCTOR, European symbol; SPICEPREFIX: L
Q1 = crystal:TC49: Temperature Compensated Xtal Oscillator HCMOS, Clipped Sine Wave or Sine Wave Compatible Source: www.pletronics.com .. tc4.pdf; OC_FARNELL: unknown; OC_NEWARK: unknown
R1-R35 = rcl:R-EU_: RESISTOR, European symbol; SPICEPREFIX: R
U$2 = PINHEADER:PINHD-2X25_D
X1 = PINHEADER:PINHD-2X25_A: PIN HEADER
X2 = SDram_dimm168:DIMM168: AMP connector
X3 = Socket14_I2C:SOCKET14_I2C
X4 = ATX_POWER-con-molex:ATX-POWER_CON_5566-20: Mini FIT connector 20 pol ATX PC-Motherboard Power connector Source: http://www.molex.com
X7 = adafruit:JST_2PIN: JST 2-Pin Connectors of various flavors SMT-RA (S2B-PH-SM4) 4UConnector #17311 SMT (B2B-PH-SM4) THM-RA (S2B-PH) THM (B2B-PH)
X9 = pinhead-2:PINHD-2X05: PIN HEADER
X21 = PINHEADER:F30BUS-2X15_D: PIN HEADER
X22 = PINHEADER:F30BUS_A